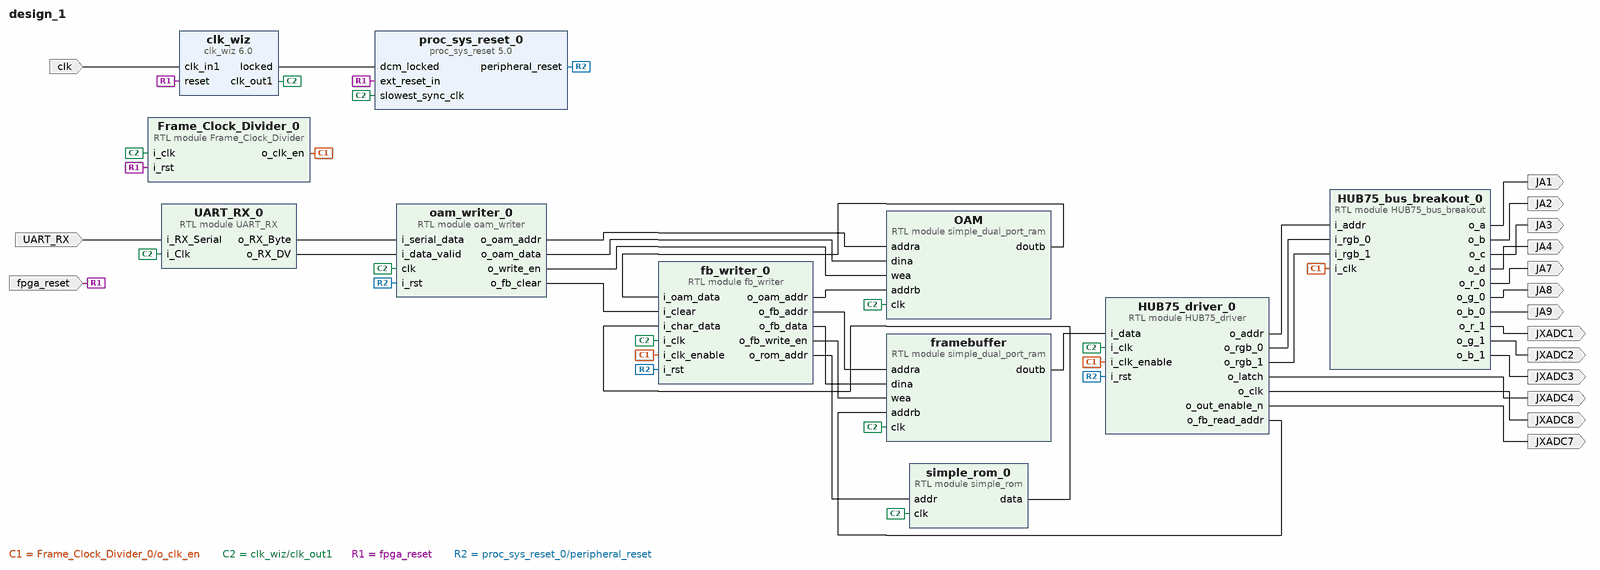
[diagram p0: block diagram of the top level]
# Vivado block design design_1, xc7a35tcpg236-1, Vivado 2024.2
create_bd_design design_1

create_bd_port -dir I -type clk clk
create_bd_port -dir I UART_RX
create_bd_port -dir I fpga_reset
create_bd_port -dir O -type data JA1
create_bd_port -dir O -type data JA2
create_bd_port -dir O -type data JA3
create_bd_port -dir O -type data JA4
create_bd_port -dir O -type data JA7
create_bd_port -dir O -type data JA8
create_bd_port -dir O -type data JA9
create_bd_port -dir O -type data JXADC1
create_bd_port -dir O -type data JXADC2
create_bd_port -dir O -type data JXADC3
create_bd_port -dir O -type data JXADC4
create_bd_port -dir O -type data JXADC7
create_bd_port -dir O -type data JXADC8

create_bd_cell -type ip -vlnv xilinx.com:ip:clk_wiz:6.0 clk_wiz
set_property -dict [list \
  CONFIG.CLKOUT1_JITTER 130.958 \
  CONFIG.CLKOUT1_PHASE_ERROR 98.575 \
  CONFIG.CLKOUT1_REQUESTED_OUT_FREQ 100.0 \
  CONFIG.CLKOUT2_JITTER 151.636 \
  CONFIG.CLKOUT2_PHASE_ERROR 98.575 \
  CONFIG.CLKOUT2_REQUESTED_OUT_FREQ 50 \
  CONFIG.CLKOUT2_USED false \
  CONFIG.CLK_IN1_BOARD_INTERFACE Custom \
  CONFIG.MMCM_CLKFBOUT_MULT_F 10.000 \
  CONFIG.MMCM_CLKOUT0_DIVIDE_F 10.000 \
  CONFIG.MMCM_CLKOUT1_DIVIDE 1 \
  CONFIG.NUM_OUT_CLKS 1 \
  CONFIG.RESET_BOARD_INTERFACE reset \
  CONFIG.USE_BOARD_FLOW true \
  CONFIG.USE_INCLK_STOPPED true \
] [get_bd_cells clk_wiz]
create_bd_cell -type ip -vlnv xilinx.com:ip:proc_sys_reset:5.0 proc_sys_reset_0
create_bd_cell -type module -reference HUB75_bus_breakout HUB75_bus_breakout_0
create_bd_cell -type module -reference UART_RX UART_RX_0
create_bd_cell -type module -reference Frame_Clock_Divider Frame_Clock_Divider_0
set_property -dict {CONFIG.counter_reset_value 20} [get_bd_cells Frame_Clock_Divider_0]
create_bd_cell -type module -reference HUB75_driver HUB75_driver_0
set_property -dict {CONFIG.g_BRIGHTNESS 100 CONFIG.g_PIXEL_COLUMNS 128} [get_bd_cells HUB75_driver_0]
create_bd_cell -type module -reference simple_dual_port_ram framebuffer
set_property -dict {CONFIG.g_MEM_DEPTH 4096} [get_bd_cells framebuffer]
create_bd_cell -type module -reference simple_rom simple_rom_0
create_bd_cell -type module -reference simple_dual_port_ram OAM
set_property -dict {CONFIG.g_MEM_DEPTH 300 CONFIG.g_MEM_WIDTH 16} [get_bd_cells OAM]
create_bd_cell -type module -reference fb_writer fb_writer_0
set_property -dict {CONFIG.g_OAM_SIZE 300 CONFIG.g_PIXEL_COLUMNS 128} [get_bd_cells fb_writer_0]
create_bd_cell -type module -reference oam_writer oam_writer_0
set_property -dict {CONFIG.g_OAM_SIZE 300} [get_bd_cells oam_writer_0]

# ---- connections ----

connect_bd_net [get_bd_pins Frame_Clock_Divider_0/o_clk_en] \
  [get_bd_pins HUB75_bus_breakout_0/i_clk] [get_bd_pins HUB75_driver_0/i_clk_enable] [get_bd_pins fb_writer_0/i_clk_enable]
connect_bd_net [get_bd_pins HUB75_bus_breakout_0/o_a] [get_bd_ports JA1]
connect_bd_net [get_bd_pins HUB75_bus_breakout_0/o_b] [get_bd_ports JA2]
connect_bd_net [get_bd_pins HUB75_bus_breakout_0/o_b_0] [get_bd_ports JA9]
connect_bd_net [get_bd_pins HUB75_bus_breakout_0/o_b_1] [get_bd_ports JXADC3]
connect_bd_net [get_bd_pins HUB75_bus_breakout_0/o_c] [get_bd_ports JA3]
connect_bd_net [get_bd_pins HUB75_bus_breakout_0/o_d] [get_bd_ports JA4]
connect_bd_net [get_bd_pins HUB75_bus_breakout_0/o_g_0] [get_bd_ports JA8]
connect_bd_net [get_bd_pins HUB75_bus_breakout_0/o_g_1] [get_bd_ports JXADC2]
connect_bd_net [get_bd_pins HUB75_bus_breakout_0/o_r_0] [get_bd_ports JA7]
connect_bd_net [get_bd_pins HUB75_bus_breakout_0/o_r_1] [get_bd_ports JXADC1]
connect_bd_net [get_bd_pins HUB75_driver_0/o_addr] [get_bd_pins HUB75_bus_breakout_0/i_addr]
connect_bd_net [get_bd_pins HUB75_driver_0/o_clk] [get_bd_ports JXADC8]
connect_bd_net [get_bd_pins HUB75_driver_0/o_fb_read_addr] [get_bd_pins framebuffer/addrb]
connect_bd_net [get_bd_pins HUB75_driver_0/o_latch] [get_bd_ports JXADC4]
connect_bd_net [get_bd_pins HUB75_driver_0/o_out_enable_n] [get_bd_ports JXADC7]
connect_bd_net [get_bd_pins HUB75_driver_0/o_rgb_0] [get_bd_pins HUB75_bus_breakout_0/i_rgb_0]
connect_bd_net [get_bd_pins HUB75_driver_0/o_rgb_1] [get_bd_pins HUB75_bus_breakout_0/i_rgb_1]
connect_bd_net [get_bd_pins OAM/doutb] [get_bd_pins fb_writer_0/i_oam_data]
connect_bd_net [get_bd_pins UART_RX_0/o_RX_Byte] [get_bd_pins oam_writer_0/i_serial_data]
connect_bd_net [get_bd_pins UART_RX_0/o_RX_DV] [get_bd_pins oam_writer_0/i_data_valid]
connect_bd_net [get_bd_ports UART_RX] [get_bd_pins UART_RX_0/i_RX_Serial]
connect_bd_net [get_bd_ports clk] [get_bd_pins clk_wiz/clk_in1]
connect_bd_net [get_bd_pins clk_wiz/clk_out1] \
  [get_bd_pins proc_sys_reset_0/slowest_sync_clk] [get_bd_pins UART_RX_0/i_Clk] [get_bd_pins Frame_Clock_Divider_0/i_clk] \
  [get_bd_pins simple_rom_0/clk] [get_bd_pins framebuffer/clk] [get_bd_pins OAM/clk] [get_bd_pins HUB75_driver_0/i_clk] \
  [get_bd_pins fb_writer_0/i_clk] [get_bd_pins oam_writer_0/clk]
connect_bd_net [get_bd_pins clk_wiz/locked] [get_bd_pins proc_sys_reset_0/dcm_locked]
connect_bd_net [get_bd_pins fb_writer_0/o_fb_addr] [get_bd_pins framebuffer/addra]
connect_bd_net [get_bd_pins fb_writer_0/o_fb_data] [get_bd_pins framebuffer/dina]
connect_bd_net [get_bd_pins fb_writer_0/o_fb_write_en] [get_bd_pins framebuffer/wea]
connect_bd_net [get_bd_pins fb_writer_0/o_oam_addr] [get_bd_pins OAM/addrb]
connect_bd_net [get_bd_pins fb_writer_0/o_rom_addr] [get_bd_pins simple_rom_0/addr]
connect_bd_net [get_bd_ports fpga_reset] \
  [get_bd_pins clk_wiz/reset] [get_bd_pins proc_sys_reset_0/ext_reset_in] [get_bd_pins Frame_Clock_Divider_0/i_rst]
connect_bd_net [get_bd_pins oam_writer_0/o_fb_clear] [get_bd_pins fb_writer_0/i_clear]
connect_bd_net [get_bd_pins oam_writer_0/o_oam_addr] [get_bd_pins OAM/addra]
connect_bd_net [get_bd_pins oam_writer_0/o_oam_data] [get_bd_pins OAM/dina]
connect_bd_net [get_bd_pins oam_writer_0/o_write_en] [get_bd_pins OAM/wea]
connect_bd_net [get_bd_pins proc_sys_reset_0/peripheral_reset] \
  [get_bd_pins HUB75_driver_0/i_rst] [get_bd_pins fb_writer_0/i_rst] [get_bd_pins oam_writer_0/i_rst]
connect_bd_net -net simple_dual_port_ram_0_doutb [get_bd_pins framebuffer/doutb] [get_bd_pins HUB75_driver_0/i_data]
connect_bd_net [get_bd_pins simple_rom_0/data] [get_bd_pins fb_writer_0/i_char_data]

validate_bd_design
save_bd_design
